# EasyEDA schematic SCH_Linefollower_2026-01-02.json
TITLE: Linefollower; REV: 1.0; Date: 2025-11-14; Sheet: 1/1; Company: Hogent
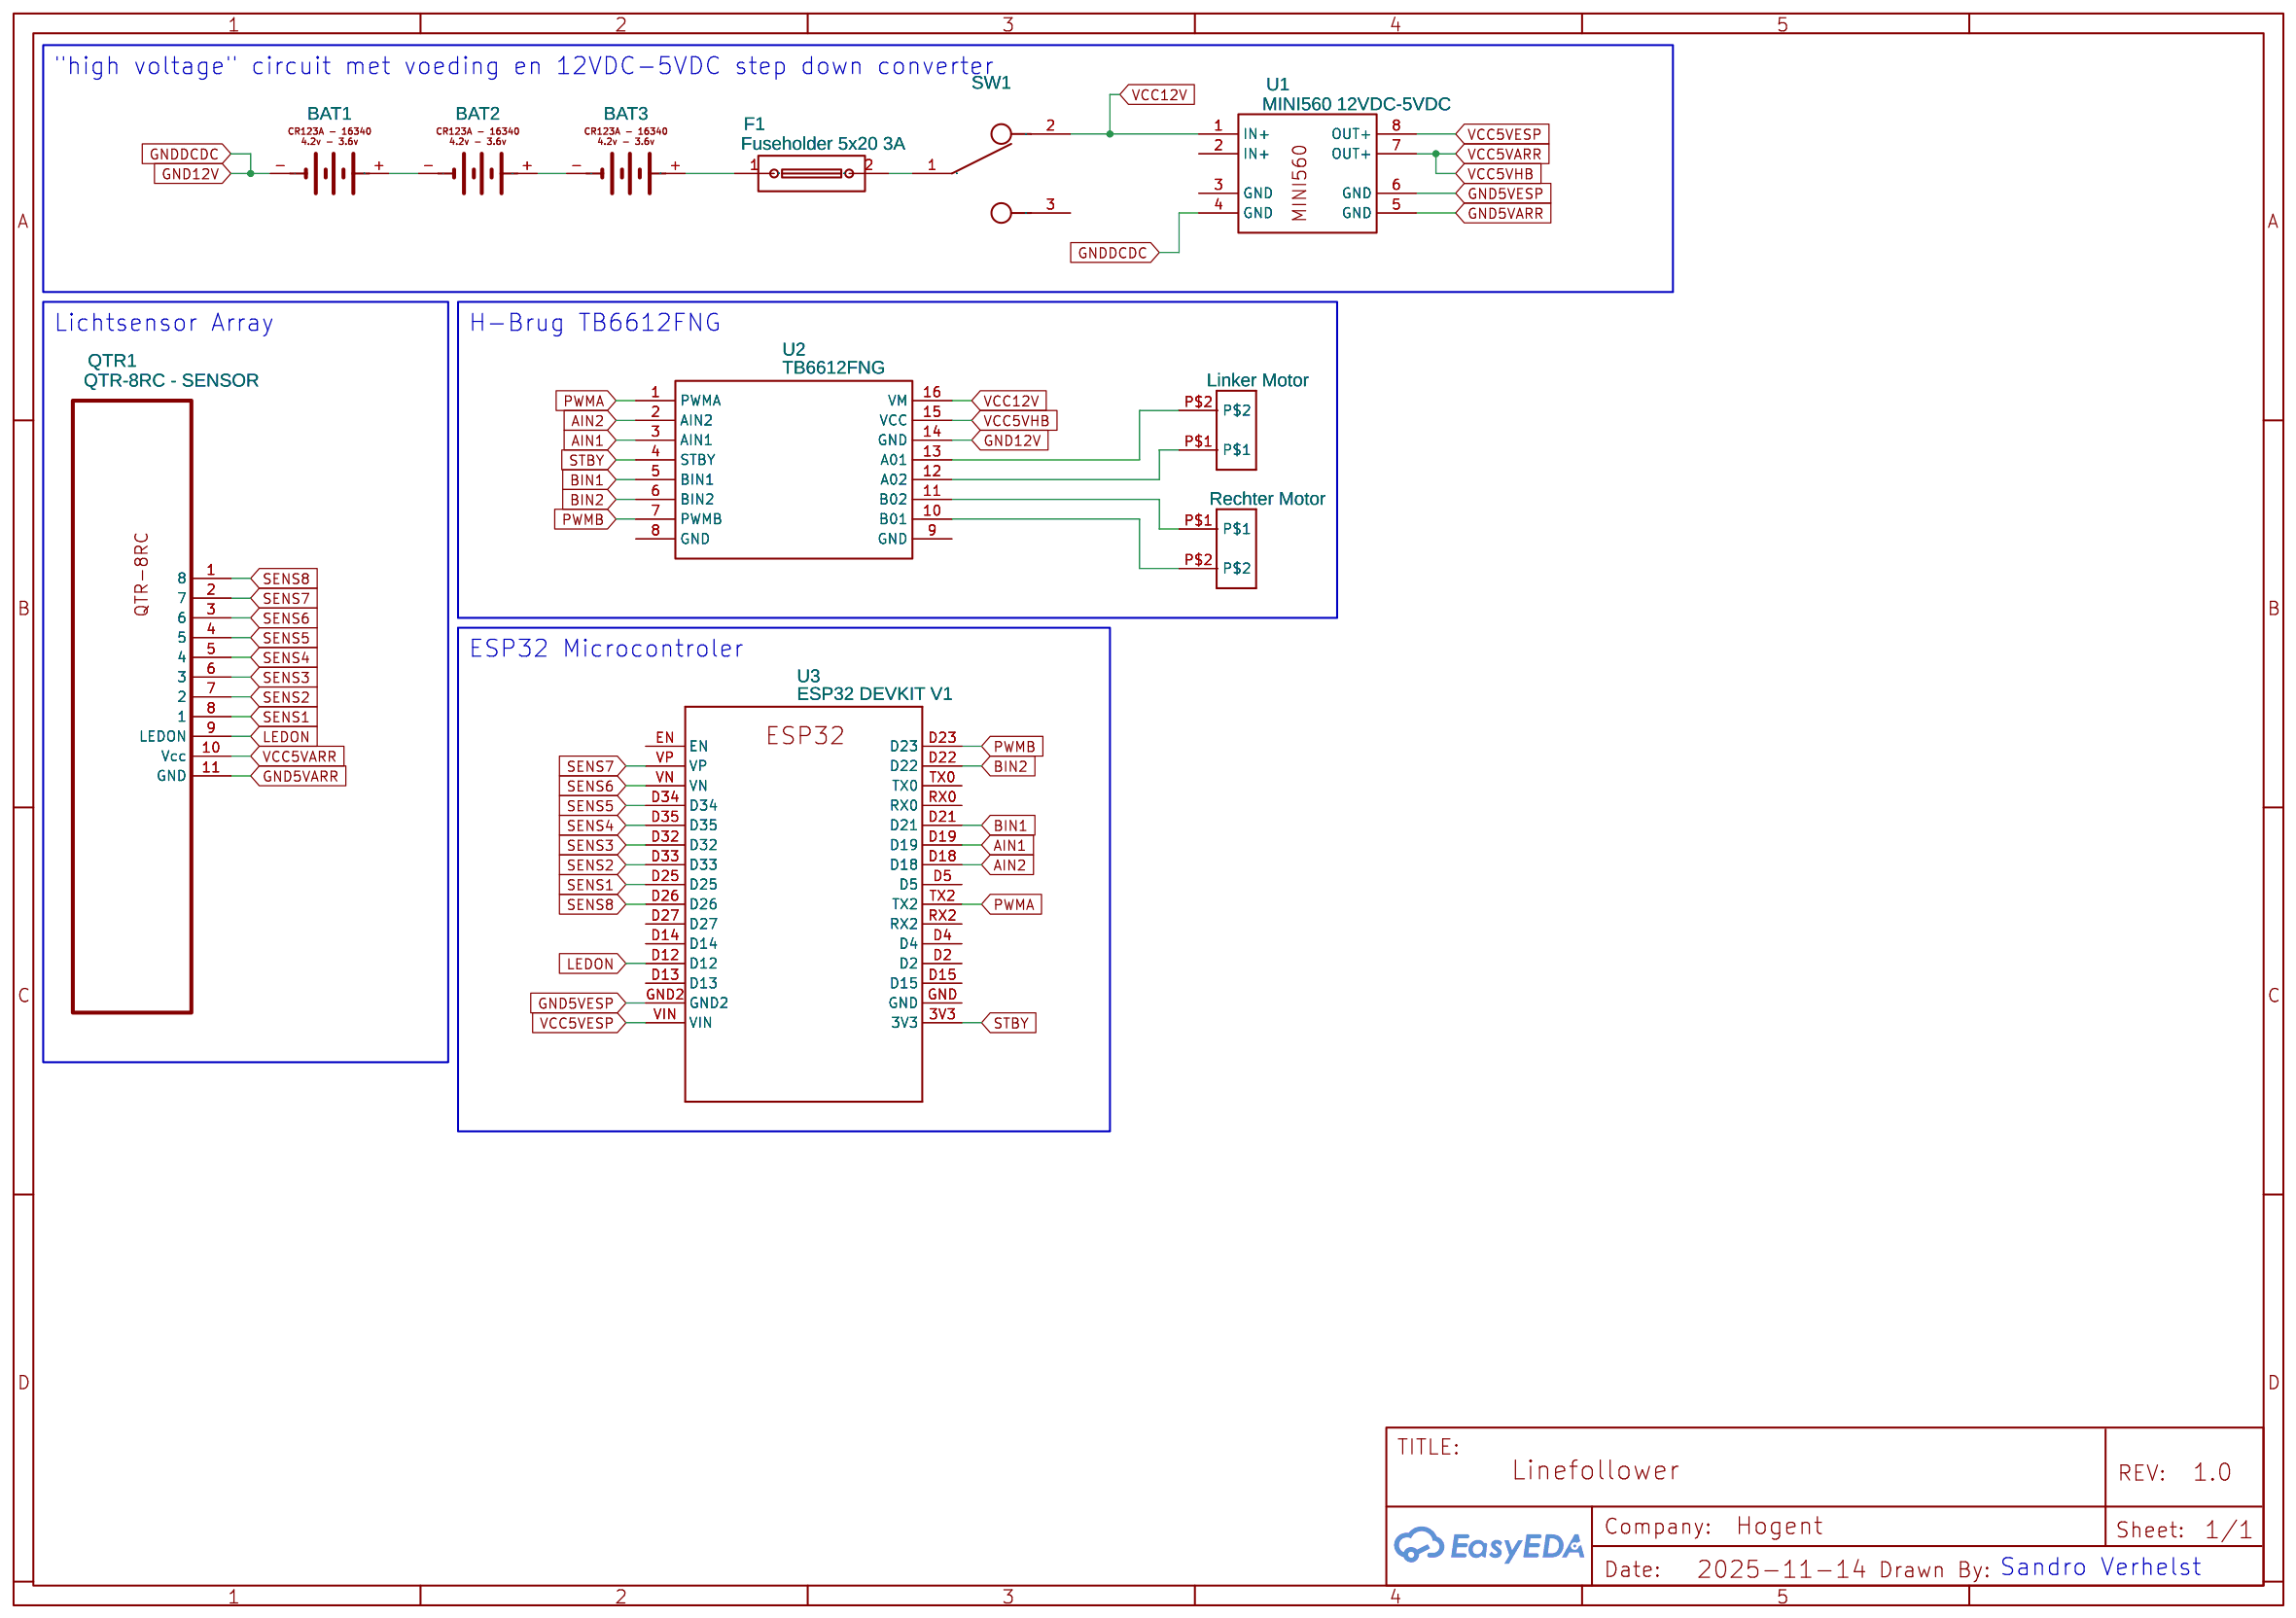
[diagram p0: schematic sheet]

## Parts
1  Rechter Motor  [2P_TERMINAL_BLOCK_PITCH_5MM]
2  Linker Motor  [2P_TERMINAL_BLOCK_PITCH_5MM]
BAT1  BHC-CR123A meo  [CR123A_HOLDER_(18340) MEO]
BAT2  BHC-CR123A meo  [CR123A_HOLDER_(18340) MEO]
BAT3  BHC-CR123A meo  [CR123A_HOLDER_(18340) MEO]
F1  Fuseholder 5x20 3A  [FUSEHOLDER_5X20]
QTR1  QTR-8RC - SENSOR  [QTR-8RC REFLECTANCE SENSOR ARRAY]
SW1  SPDT_TOGGLE_SWITCH_4.7MM  [SPDT_TOGGLE_SWITCH_4.7MM]
U1  MINI560 12VDC-5VDC  [MINI560_DC-DC]
U2  TB6612FNG  [TB6612FNG]
U3  ESP32 DEVKIT V1  [ESP32-DEVKITV1_ESP32-DEVKITV1]

## Library data of the parts
1 2 = 2P_TERMINAL_BLOCK_PITCH_5MM: Contributor: Sushant Raut
BAT1-BAT3 = BHC-CR123A meo: CR123A (23rd AA) battery holder; Contributor: PaoloSerena
F1 = Fuse_holder_5x20: Supplier: LCSC; Manufacturer Part: 5x20 BLX-Atype Fuse holder XC-7; Manufacturer: XCFuse; image: //image.lceda.cn/szlcsc/C3131.jpg; Supplier Part: C3131; Contributor: Vitus Nagler
QTR1 = QTR-8RC - SENSOR: Manufacturer Part: 961; Contributor: PiterSantaCruz; Supplier Part: 961; Supplier: Pololu; Manufacturer: Pololu; link: https://www.pololu.com/product/961
SW1 = SPDT_TOGGLE_SWITCH_4.7MM: Manufacturer: ANT11SF1CQE; Manufacturer Part: CIT; Supplier: Digi-Key; Supplier Part: 2449-ANT11SF1CQE-ND; Contributor: ribbert
U1 = MINI560_DC-DC COPY: Contributor: mengrie
U2 = TB6612FNG: Contributor: yehan
U3 = ESP32-DEVKIT-V1-30PIN: Contributor: facuumz

## Nets
GND5VARR: QTR1.11(GND) U1.5(GND)
GND5VESP: U1.6(GND) U3.GND2
GND12V: BAT1.- U1.4(GND) U2.14(GND)
VCC5VARR: QTR1.10(Vcc) U1.7(OUT+) U2.15(VCC)
VCC5VESP: U1.8(OUT+) U3.VIN
VCC12V: SW1.2 U1.1(IN+) U2.16(VM)
AIN1: U2.3(AIN1) U3.D19
AIN2: U2.2(AIN2) U3.D18
BIN1: U2.5(BIN1) U3.D21
BIN2: U2.6(BIN2) U3.D22
LEDON: QTR1.9(LEDON) U3.D12
PWMA: U2.1(PWMA) U3.TX2
PWMB: U2.7(PWMB) U3.D23
SENS1: QTR1.8(1) U3.D25
SENS2: QTR1.7(2) U3.D33
SENS3: QTR1.6(3) U3.D32
SENS4: QTR1.5(4) U3.D35
SENS5: QTR1.4(5) U3.D34
SENS6: QTR1.3(6) U3.VN
SENS7: QTR1.2(7) U3.VP
SENS8: QTR1.1(8) U3.D26
STBY: U2.4(STBY) U3.3V3
Net-(1-P$1): 1.P$1 U2.11(B02)
Net-(1-P$2): 1.P$2 U2.10(B01)
Net-(2-P$1): 2.P$1 U2.12(A02)
Net-(2-P$2): 2.P$2 U2.13(A01)
Net-(BAT1-+): BAT1.+ BAT2.-
Net-(BAT2-+): BAT2.+ BAT3.-
Net-(BAT3-+): BAT3.+ F1.1
Net-(F1-2): F1.2 SW1.1

Not connected (* = marked no-connect by the designer): SW1 3; U1 2(IN+) 3(GND); U2 8(GND) 9(GND); U3 D2 D4 D5 D13 D14 D15 D27 EN GND RX0 RX2 TX0

## Notes on the sheet
- "high voltage" circuit met voeding en 12VDC-5VDC step down converter
- Lichtsensor Array
- H-Brug TB6612FNG
- ESP32 Microcontroler
- Sandro Verhelst
